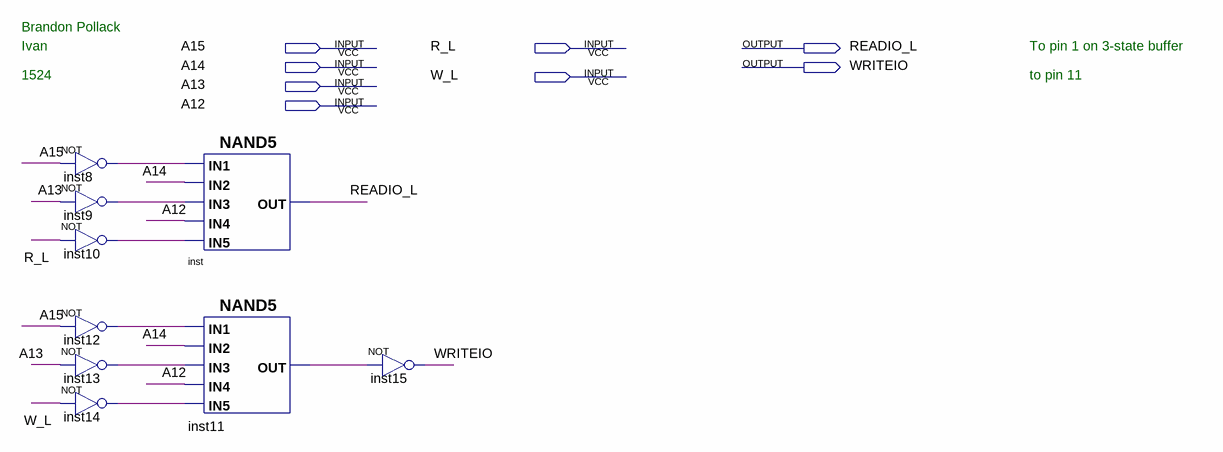
[diagram p0: schematic sheet]
// Quartus schematic AddressDecode.bdf as structural Verilog: 9 symbols, 8 pins
module AddressDecode (
  input  A15,
  input  R_L,
  input  A14,
  input  W_L,
  input  A13,
  input  A12,
  output READIO_L,
  output WRITEIO
);

  wire inst8_out, inst9_out, inst10_out, inst11_out, inst12_out, inst13_out, inst14_out;

  not inst8 (inst8_out, A15);
  not inst9 (inst9_out, A13);
  not inst10 (inst10_out, R_L);
  not inst12 (inst12_out, A15);
  not inst13 (inst13_out, A13);
  not inst14 (inst14_out, W_L);
  nand inst (READIO_L, inst8_out, A14, inst9_out, A12, inst10_out);
  nand inst11 (inst11_out, inst12_out, A14, inst13_out, A12, inst14_out);
  not inst15 (WRITEIO, inst11_out);

  // Notes on the sheet:
  //   Brandon Pollack
  //   Ivan
  //   To pin 1 on 3-state buffer
  //   1524
  //   to pin 11
endmodule
